# EAGLE design Rib (EAGLE 8.6.3)
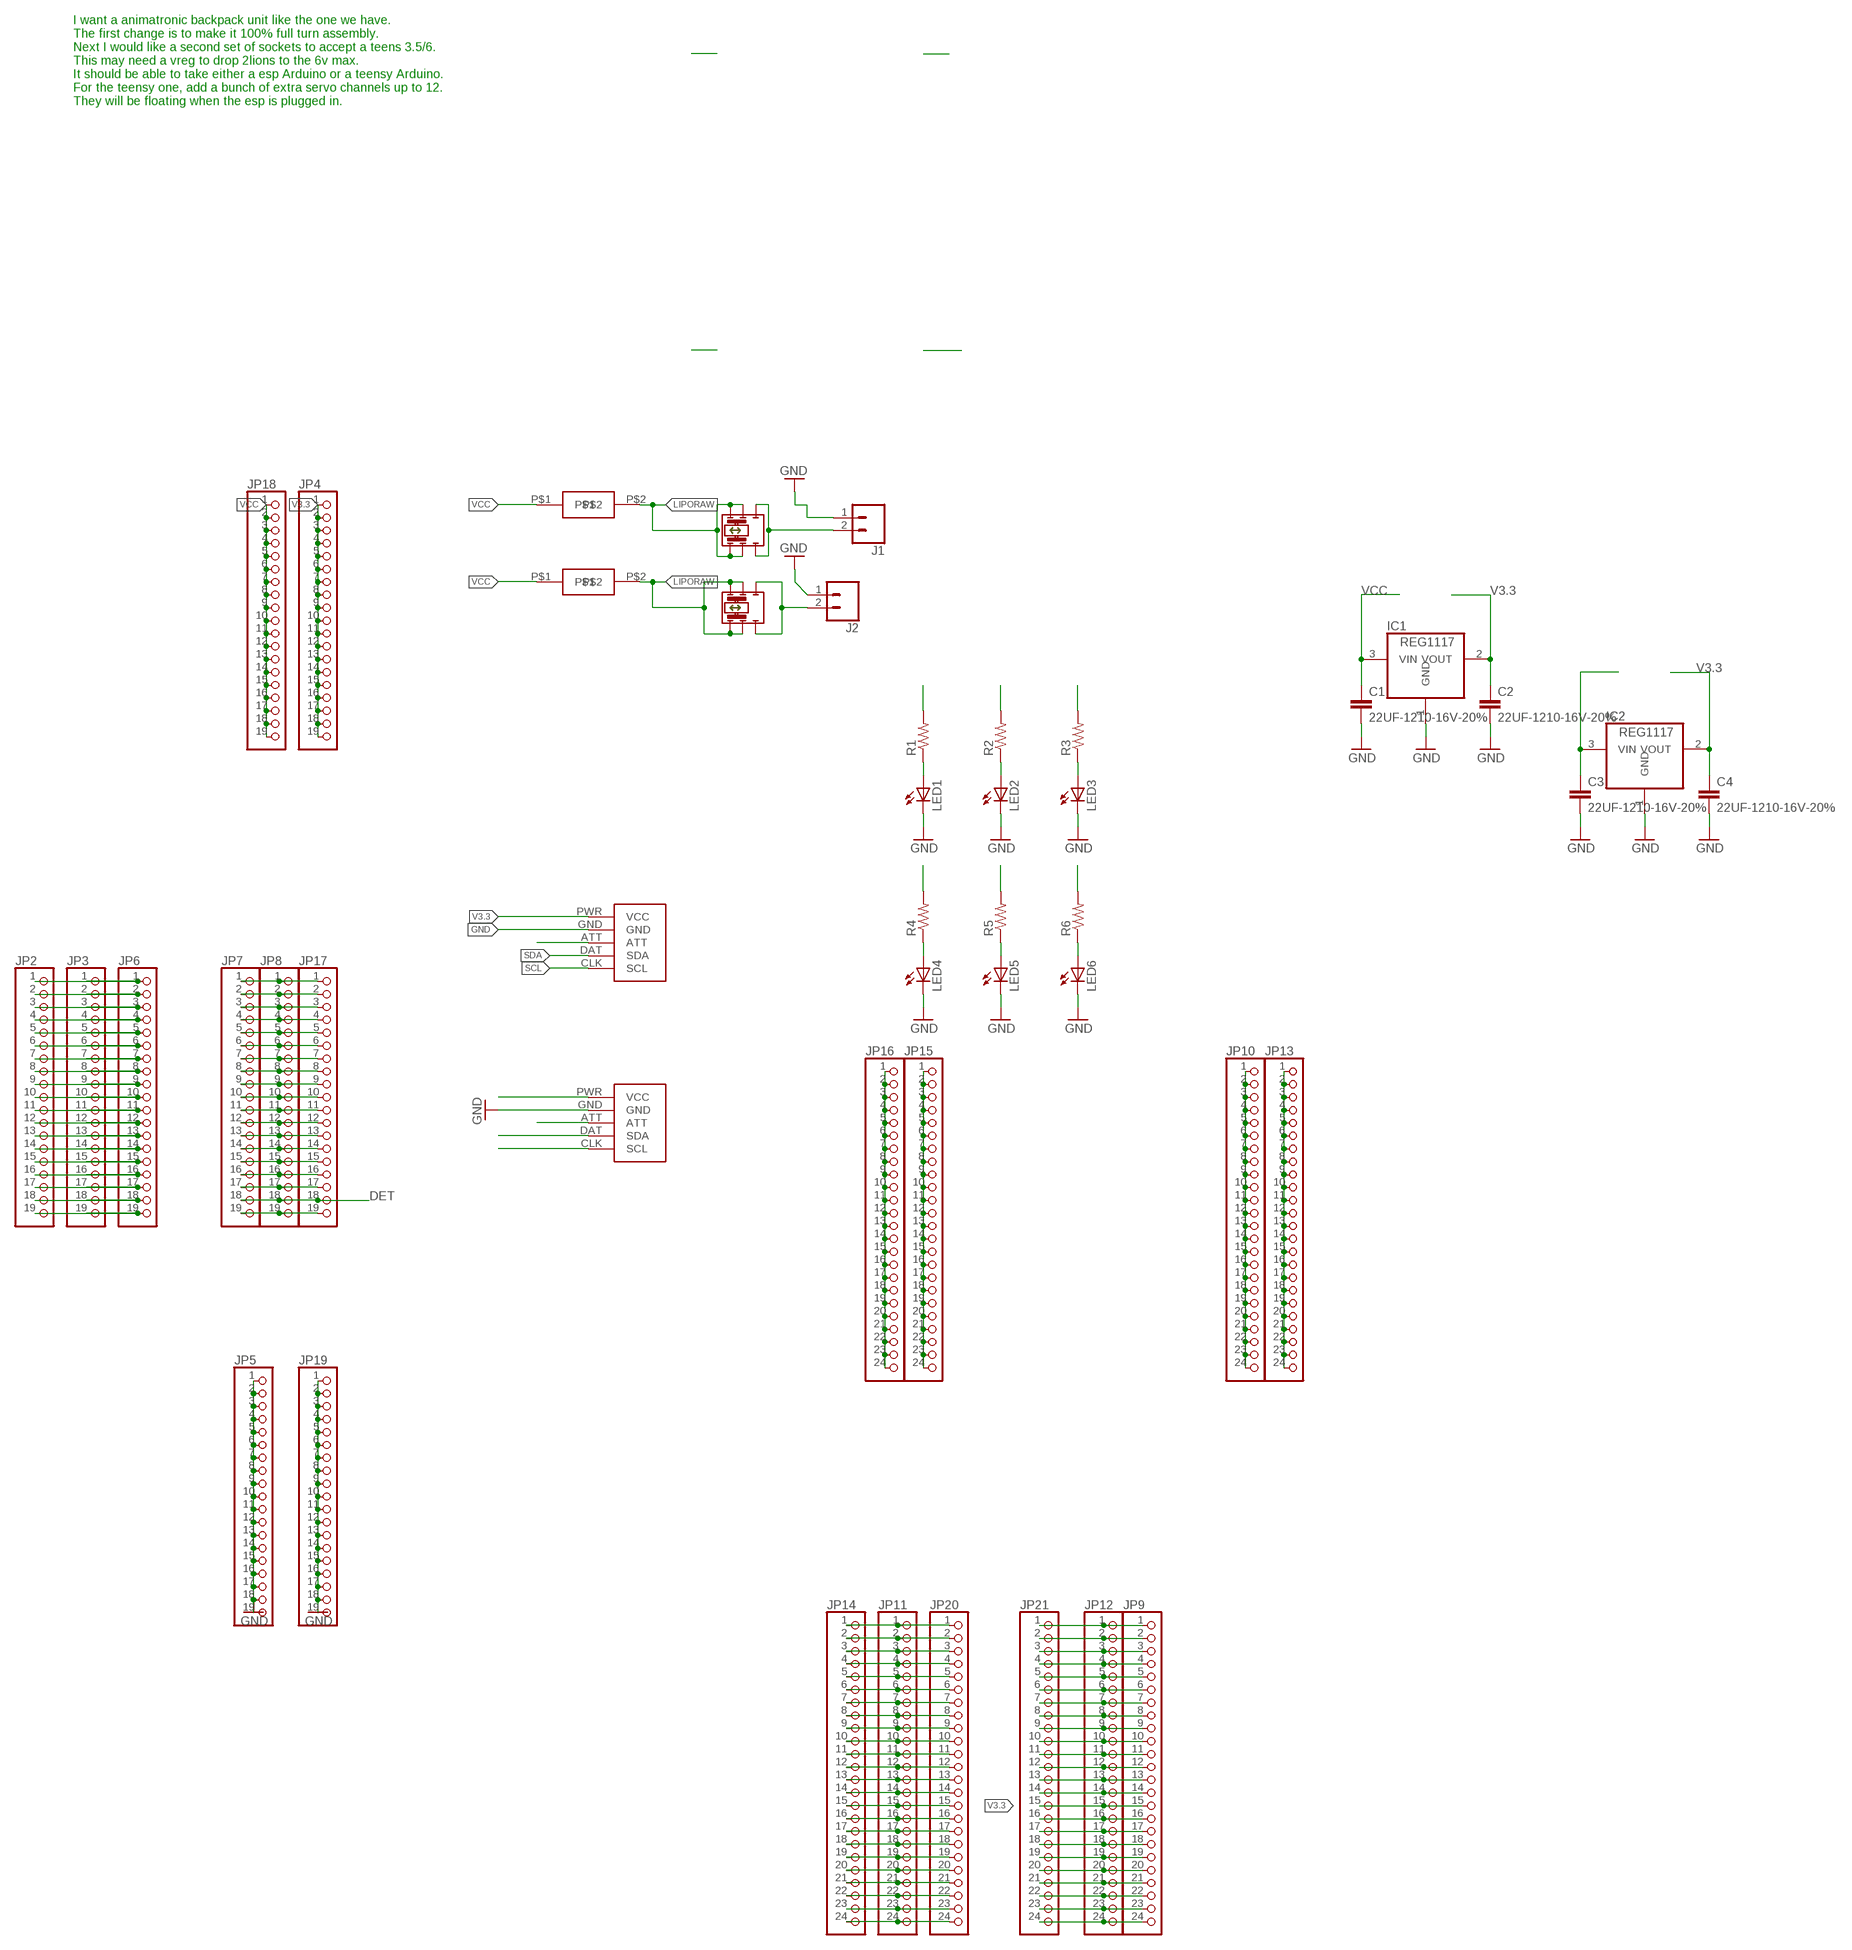
[diagram p0: schematic, sheet 1]

## Parts
C1  22UF-1210-16V-20%  [1210]
C2  22UF-1210-16V-20%  [1210]
C3  22UF-1210-16V-20%  [1210]
C4  22UF-1210-16V-20%  [1210]
F3  3557-2  [3557-2]
F4  3557-2  [3557-2]
IC1  REG1117  [SOT223]
IC2  REG1117  [SOT223]
J1  CONN_023.5MM_LOCK  [SCREWTERMINAL-3.5MM-2_LOCK]
J2  CONN_023.5MM_LOCK  [SCREWTERMINAL-3.5MM-2_LOCK]
JP2  PINHD-1X19  [1X19]
JP3  PINHD-1X19  [1X19]
JP4  PINHD-1X19  [1X19]
JP5  PINHD-1X19  [1X19]
JP6  PINHD-1X19  [1X19]
JP7  PINHD-1X19  [1X19]
JP8  PINHD-1X19  [1X19]
JP9  PINHD-1X24  [1X24]
JP10  PINHD-1X24  [1X24]
JP11  PINHD-1X24  [1X24]
JP12  PINHD-1X24  [1X24]
JP13  PINHD-1X24  [1X24]
JP14  PINHD-1X24  [1X24]
JP15  PINHD-1X24  [1X24]
JP16  PINHD-1X24  [1X24]
JP17  PINHD-1X19  [1X19]
JP18  PINHD-1X19  [1X19]
JP19  PINHD-1X19  [1X19]
JP20  PINHD-1X24  [1X24]
JP21  PINHD-1X24  [1X24]
LED1  LED_ESML0603  [LED_SML0603]
LED2  LED_ESML0603  [LED_SML0603]
LED3  LED_ESML0603  [LED_SML0603]
LED4  LED_ESML0603  [LED_SML0603]
LED5  LED_ESML0603  [LED_SML0603]
LED6  LED_ESML0603  [LED_SML0603]
R1  R-US_R0603  [R0603]
R2  R-US_R0603  [R0603]
R3  R-US_R0603  [R0603]
R4  R-US_R0603  [R0603]
R5  R-US_R0603  [R0603]
R6  R-US_R0603  [R0603]
SW1  DPDT  [GF-126-0327]
SW2  DPDT  [GF-126-0327]
U$3  WIICHUCK  [CHUCK]
U$5  WIICHUCK  [CHUCK]

## Nets
5V: JP2.1 JP3.1 JP6.1 JP11.1 JP14.1 JP20.1
DET: JP7.18 JP8.18 JP9.24 JP12.24 JP17.18 JP21.24 U$3.ATT U$5.ATT
GND: C1.2 C2.2 C3.2 C4.2 IC1.1(GND) IC2.1(GND) J1.1 J2.1 JP2.6 JP3.6 JP5.1 JP5.2 JP5.3 JP5.4 JP5.5 JP5.6 JP5.7 JP5.8 JP5.9 JP5.10 JP5.11 JP5.12 JP5.13 JP5.14 JP5.15 JP5.16 JP5.17 JP5.18 JP5.19 JP6.6 JP7.13 JP7.19 JP8.13 JP8.19 JP9.1 JP11.2 JP11.15 JP12.1 JP13.1 JP13.2 JP13.3 JP13.4 JP13.5 JP13.6 JP13.7 JP13.8 JP13.9 JP13.10 JP13.11 JP13.12 JP13.13 JP13.14 JP13.15 JP13.16 JP13.17 JP13.18 JP13.19 JP13.20 JP13.21 JP13.22 JP13.23 JP13.24 JP14.2 JP14.15 JP16.1 JP16.2 JP16.3 JP16.4 JP16.5 JP16.6 JP16.7 JP16.8 JP16.9 JP16.10 JP16.11 JP16.12 JP16.13 JP16.14 JP16.15 JP16.16 JP16.17 JP16.18 JP16.19 JP16.20 JP16.21 JP16.22 JP16.23 JP16.24 JP17.13 JP17.19 JP19.1 JP19.2 JP19.3 JP19.4 JP19.5 JP19.6 JP19.7 JP19.8 JP19.9 JP19.10 JP19.11 JP19.12 JP19.13 JP19.14 JP19.15 JP19.16 JP19.17 JP19.18 JP19.19 JP20.2 JP20.15 JP21.1 LED1.C LED2.C LED3.C LED4.C LED5.C LED6.C U$3.GND U$5.GND
LIPORAW: F3.P$2 F4.P$2 R2.2 R5.2 SW1.A1 SW1.A2 SW1.B1 SW1.B2 SW2.A1 SW2.A2 SW2.B1 SW2.B2
N$1: JP11.23 JP14.23 JP20.23
N$6: JP11.24 JP14.24 JP20.24
N$7: JP2.2 JP3.2 JP6.2
N$8: JP2.3 JP3.3 JP6.3
N$9: JP2.4 JP3.4 JP6.4
N$10: JP2.5 JP3.5 JP6.5
N$11: J1.2 SW1.C1 SW1.C2
N$12: JP2.7 JP3.7 JP6.7
N$13: JP2.8 JP3.8 JP6.8
N$14: JP2.9 JP3.9 JP6.9
N$15: JP2.10 JP3.10 JP6.10
N$16: JP2.11 JP3.11 JP6.11
N$17: JP2.12 JP3.12 JP6.12
N$18: JP2.13 JP3.13 JP6.13
N$19: JP2.14 JP3.14 JP6.14
N$20: JP2.15 JP3.15 JP6.15
N$21: JP2.16 JP3.16 JP6.16
N$22: JP2.17 JP3.17 JP6.17
N$23: JP2.18 JP3.18 JP6.18
N$24: LED1.A R1.1
N$25: JP7.1 JP8.1 JP17.1
N$26: JP7.2 JP8.2 JP17.2
N$27: JP7.3 JP8.3 JP17.3
N$28: JP7.4 JP8.4 JP17.4
N$29: JP7.5 JP8.5 JP17.5
N$30: JP7.6 JP8.6 JP17.6
N$31: JP7.7 JP8.7 JP17.7
N$32: JP7.8 JP8.8 JP17.8
N$33: JP7.9 JP8.9 JP17.9
N$34: JP7.10 JP8.10 JP17.10
N$35: JP7.11 JP8.11 JP17.11
N$36: JP7.12 JP8.12 JP17.12
N$37: LED2.A R2.1
N$38: LED3.A R3.1
N$39: J2.2 SW2.C1 SW2.C2
N$40: LED4.A R4.1
N$41: LED5.A R5.1
N$42: LED6.A R6.1
N$62: JP11.3 JP14.3 JP20.3
N$63: JP11.4 JP14.4 JP20.4
N$64: JP11.5 JP14.5 JP20.5
N$65: JP11.6 JP14.6 JP20.6
N$66: JP11.7 JP14.7 JP20.7
N$69: JP11.10 JP14.10 JP20.10
N$70: JP11.11 JP14.11 JP20.11
N$71: JP11.12 JP14.12 JP20.12
N$72: JP11.13 JP14.13 JP20.13
N$73: JP11.14 JP14.14 JP20.14
N$75: JP11.16 JP14.16 JP20.16
N$76: JP11.17 JP14.17 JP20.17
N$77: JP11.18 JP14.18 JP20.18
N$78: JP11.19 JP14.19 JP20.19
N$79: JP11.20 JP14.20 JP20.20
N$80: JP11.21 JP14.21 JP20.21
N$81: JP11.22 JP14.22 JP20.22
N$85: JP9.2 JP12.2 JP21.2
N$86: JP9.3 JP12.3 JP21.3
N$87: JP9.4 JP12.4 JP21.4
N$88: JP9.5 JP12.5 JP21.5
N$89: JP9.6 JP12.6 JP21.6
N$90: JP9.7 JP12.7 JP21.7
N$91: JP9.8 JP12.8 JP21.8
N$92: JP9.9 JP12.9 JP21.9
N$93: JP9.10 JP12.10 JP21.10
N$96: JP9.13 JP12.13 JP21.13
N$97: JP9.14 JP12.14 JP21.14
N$99: JP9.16 JP12.16 JP21.16
N$100: JP9.17 JP12.17 JP21.17
N$101: JP9.18 JP12.18 JP21.18
N$102: JP9.19 JP12.19 JP21.19
N$103: JP9.20 JP12.20 JP21.20
N$104: JP9.21 JP12.21 JP21.21
N$105: JP9.22 JP12.22 JP21.22
N$106: JP9.23 JP12.23 JP21.23
RX0: JP7.15 JP8.15 JP9.12 JP12.12 JP17.15 JP21.12
SCL: JP7.17 JP8.17 JP11.8 JP14.8 JP17.17 JP20.8 U$3.CLK(SCL) U$5.CLK(SCL)
SDA: JP7.14 JP8.14 JP11.9 JP14.9 JP17.14 JP20.9 U$3.DAT(SDA) U$5.DAT(SDA)
TX0: JP7.16 JP8.16 JP9.11 JP12.11 JP17.16 JP21.11
V3.3: C2.1 C4.1 IC1.2(VOUT) IC2.2(VOUT) JP2.19 JP3.19 JP4.1 JP4.2 JP4.3 JP4.4 JP4.5 JP4.6 JP4.7 JP4.8 JP4.9 JP4.10 JP4.11 JP4.12 JP4.13 JP4.14 JP4.15 JP4.16 JP4.17 JP4.18 JP4.19 JP6.19 JP9.15 JP10.1 JP10.2 JP10.3 JP10.4 JP10.5 JP10.6 JP10.7 JP10.8 JP10.9 JP10.10 JP10.11 JP10.12 JP10.13 JP10.14 JP10.15 JP10.16 JP10.17 JP10.18 JP10.19 JP10.20 JP10.21 JP10.22 JP10.23 JP10.24 JP12.15 JP21.15 R3.2 R6.2 U$3.PWR(VCC) U$5.PWR(VCC)
VCC: C1.1 C3.1 F3.P$1 F4.P$1 IC1.3(VIN) IC2.3(VIN) JP15.1 JP15.2 JP15.3 JP15.4 JP15.5 JP15.6 JP15.7 JP15.8 JP15.9 JP15.10 JP15.11 JP15.12 JP15.13 JP15.14 JP15.15 JP15.16 JP15.17 JP15.18 JP15.19 JP15.20 JP15.21 JP15.22 JP15.23 JP15.24 JP18.1 JP18.2 JP18.3 JP18.4 JP18.5 JP18.6 JP18.7 JP18.8 JP18.9 JP18.10 JP18.11 JP18.12 JP18.13 JP18.14 JP18.15 JP18.16 JP18.17 JP18.18 JP18.19 R1.2 R4.2

## Notes on the sheet
- I want a animatronic backpack unit like the one we have.
  The first change is to make it 100% full turn assembly.
  Next I would like a second set of sockets to accept a teens 3.5/6. 
  This may need a vreg to drop 2lions to the 6v max.
  It should be able to take either a esp Arduino or a teensy Arduino.
  For the teensy one, add a bunch of extra servo channels up to 12. 
  They will be floating when the esp is plugged in.

## Library data of the parts
C1-C4 = SparkFun-Capacitors:22UF: 22µF ceramic capacitors A capacitor is a passive two-terminal electrical component used to store electrical energy temporarily in an electric field.
F3 F4 = 3557-2:3557-2
IC1 IC2 = burr-brown:REG1117: 800mA and 1A Low Dropout (LDO) Positive Regulator 1.8V, 2.5V, 2.85V, 3.3V, 5V, and Adj; MPN: REG1117; OC_FARNELL: 1097566; OC_NEWARK: 14P6981
J1 J2 = SparkFun-Connectors:CONN_02: Multi connection point. Often used as Generic Header-pin footprint for 0.1 inch spaced/style header connections On any of the 0.1 inch spaced packages, you can populate with these: Break Away Headers - Straight <https://www.sparkfun.com/products/116> (PRT-00116) Break Away Male Headers - Right Angle <https://www.sparkfun.com/products/553> (PRT-00553) Female Headers <https://www.sparkfun.com/products/115> (PRT-00115) Break Away Headers - Machine Pin <https://www.sparkfun.com/products/117> (PRT-00117) Break Away Female Headers - Swiss Machine Pin <https://www.sparkfun.com/products/743> (PRT-00743) For SCREWTERMINALS and SPRING TERMINALS visit here: Screw Terimnals on SparkFun.com <https://www.sparkfun.com/search/results?term=Screw+Terminals> (5mm/3.5mm/2.54mm spacing) This device is also useful as a general connection point to wire up your design to another part of your project. Our various solder wires solder well into these plated through hole pads. Hook-Up Wire - Assortment (Stranded, 22 AWG) <https://www.sparkfun.com/products/11375> (PRT-11375) Hook-Up Wire - Assortment (Solid Core, 22 AWG) <https://www.sparkfun.com/products/11367> (PRT-11367) View the entire wire category on our website here <https://www.sparkfun.com/categories/141> Special notes: Molex polarized connector foot print use with: PRT-08233 with associated crimp pins and housings. 2.54_SCREWTERM for use with PRT-10571. 3.5mm Screw Terminal footprints for PRT-08084 5mm Screw Terminal footprints for use with PRT-08432; PROD_ID: CONN-08399
JP2-JP8 JP17-JP19 = headers:PINHD-1X19: PIN HEADER
JP9-JP16 JP20 JP21 = headers:PINHD-1X24: PIN HEADER
LED1-LED6 = eagle-ltspice:LED_E: LED Source: http://www.osram.convergy.de Source: www.luxeon.com Source: www.kingbright.com; SPICEMODEL: NONE; SPICEPREFIX: D; SPICETYPE: diode
R1-R6 = resistor:R-US_: RESISTOR, American symbol
SW1 SW2 = GF-126-0327:DPDT
U$3 U$5 = wiichuck:WIICHUCK

## Board
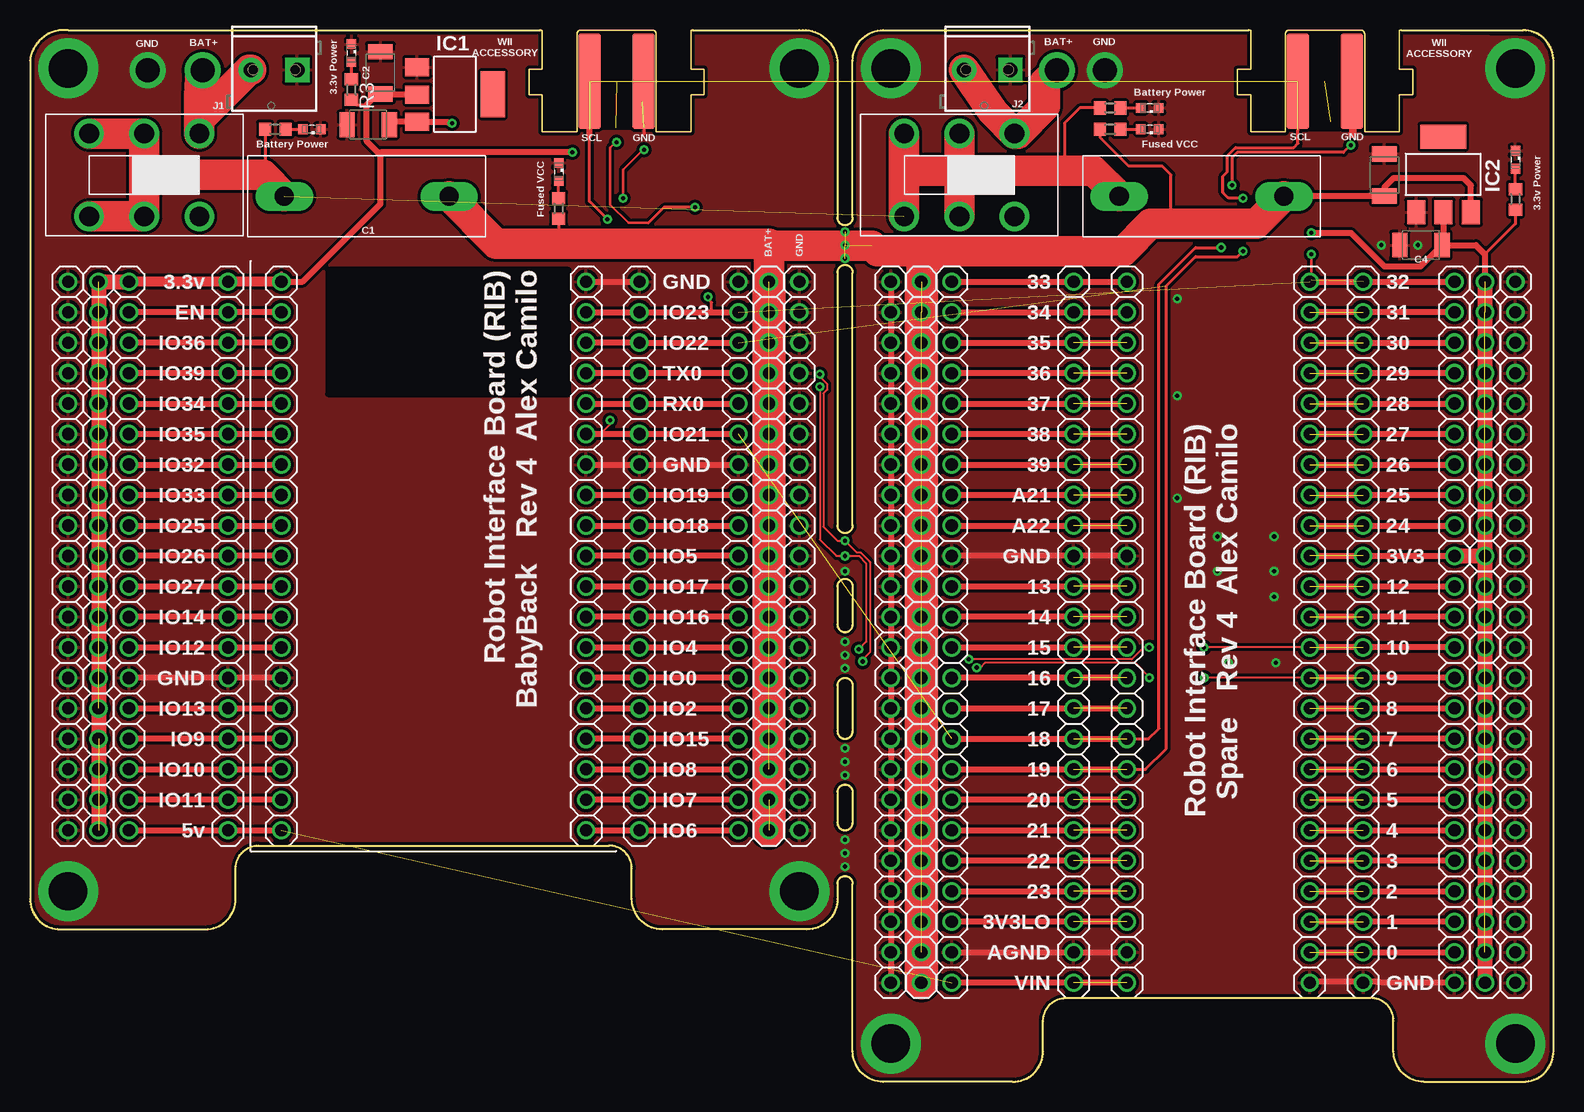
[diagram p1: board, top side]
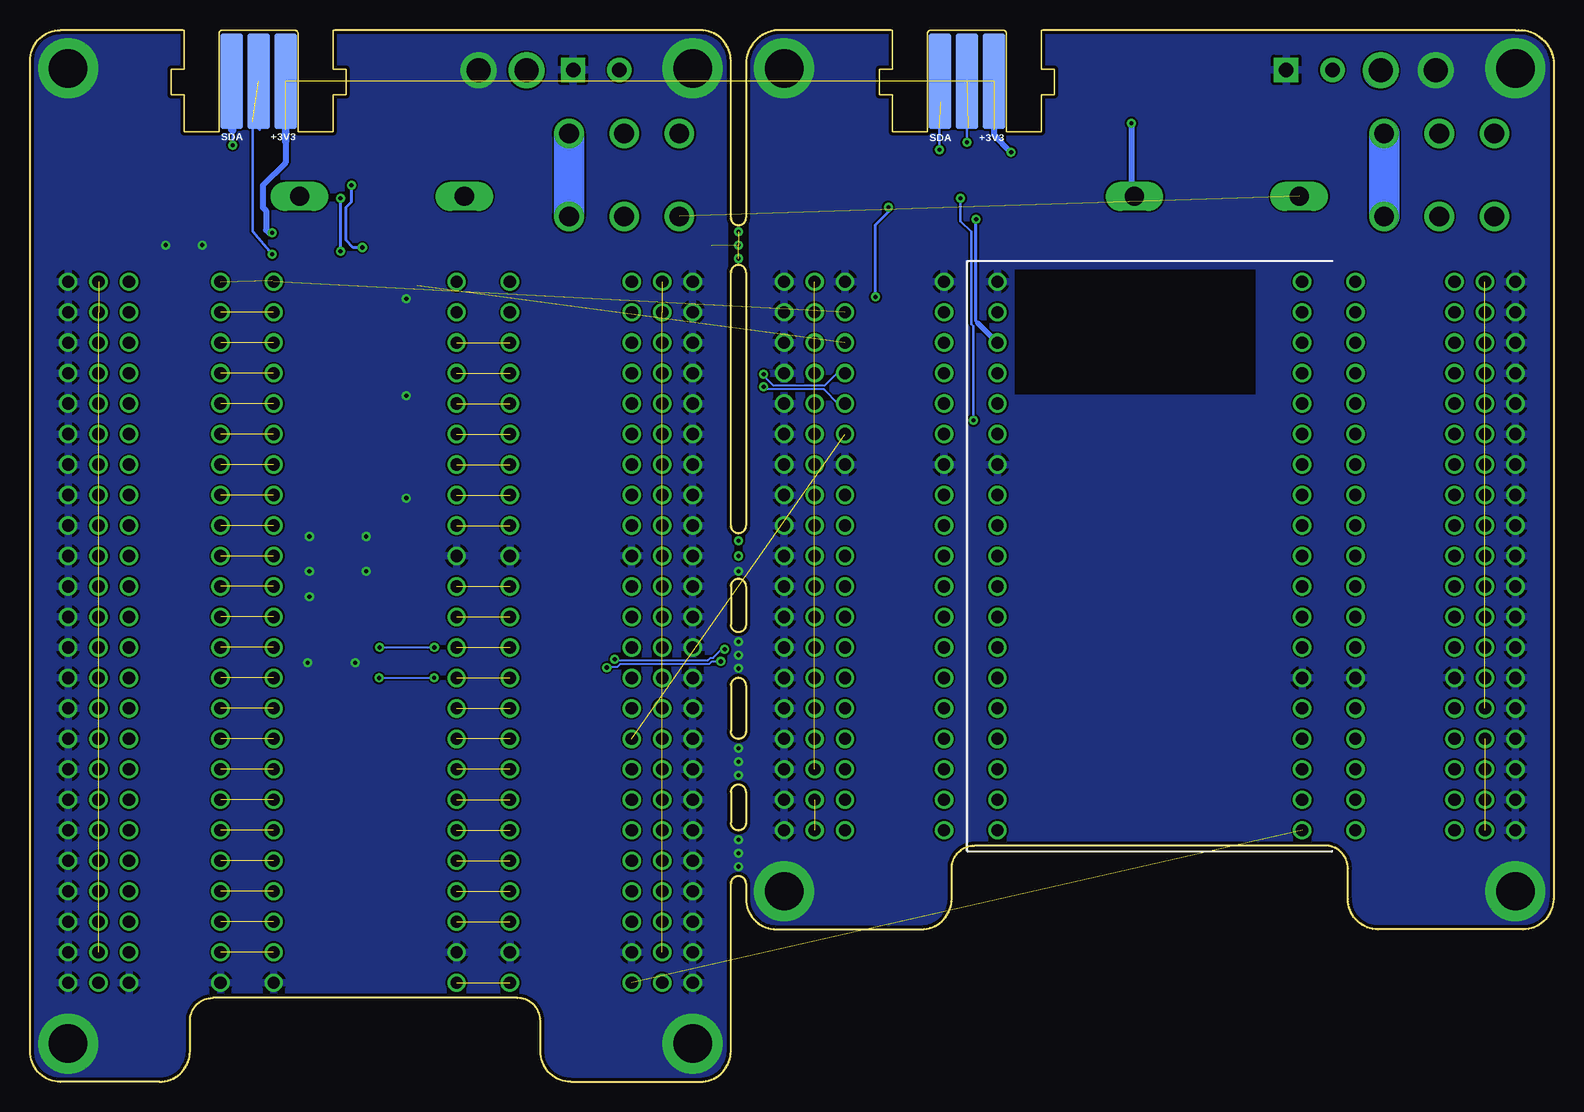
[diagram p2: board, bottom side, seen from below]

Size 127 x 87.65 mm. Coordinates in mm from the lower left corner, seen from the top.
Outline: 42.55,87.63 3.17,87.63 arc90 0,85.09 0,15.24 arc90 2.54,12.7 14.6,12.7 arc90 17.14,15.24 17.14,17.78 arc-90 19.05,19.68 48.26,19.68 arc-90 50.16,17.78 50.16,15.24 arc90 52.7,12.7 64.77,12.7 arc90 67.31,15.24 67.31,16.51 arc-90 67.94,17.14 arc-90 68.58,16.51 68.58,2.54 arc90 71.12,0 81.91,0 arc90 84.46,2.54 84.46,5.08 arc-90 86.36,6.98 111.76,6.98 arc-90 113.66,5.08 113.66,2.54 arc90 116.21,0 124.46,0 arc90 127,2.54 127,85.09 arc90 124.46,87.63 114.3,87.63
Outline: 55.24,87.63 64.13,87.63 arc-90 67.31,85.09 67.31,72.01 arc90 67.94,71.37 arc90 68.58,72.01 68.58,85.09 arc-90 71.12,87.63 101.6,87.63
Outline: 67.31,67.44 arc-90 67.94,68.07 arc-90 68.58,67.44 68.58,46.36 arc-90 67.94,45.72 arc-90 67.31,46.36 67.31,67.44
Outline: 67.31,21.59 arc90 67.94,20.95 arc90 68.58,21.59 68.58,24.13 arc90 67.94,24.77 arc90 67.31,24.13 67.31,21.59
Outline: 67.31,41.27 arc-90 67.94,41.91 arc-90 68.58,41.27 68.58,38.1 arc-90 67.94,37.47 arc-90 67.31,38.1 67.31,41.27
Outline: 67.31,29.21 arc90 67.94,28.57 arc90 68.58,29.21 68.58,33.02 arc90 67.94,33.66 arc90 67.31,33.02 67.31,29.21
Copper layers (1*16): Top 0.035mm / dielectric 1.5mm / Bottom 0.035mm
Design rules "default *": minimum track width 6mil, minimum drill 0.35mm, track to track 6mil, track to pad 6mil, pad to pad 6mil, via to via 6mil, smd to smd 6mil, copper to edge 10mil, drill to drill 6mil, minimum pad ring 10mil, minimum via ring 8mil, stop-mask expansion 4mil, vias tented up to drill 30mil, thermal gap 10mil
tRestrict: area 45.2,79.6 to 52.7,88.3; area 104.1,79.5 to 111.6,88.1; area 24.8,57.3 to 44.9,67.7
bRestrict: area 104.2,79.4 to 111.6,88.1; area 45.2,79.6 to 52.7,88.3; area 24.8,57.3 to 44.9,67.7; area 67.1,67.8 to 68.8,71.7

### Footprints (pad centres in the part's own frame; a part is rotated, then mirrored left to right if it is on the bottom)
1210 = smd 1.27 x 2.06: 1 -1.755,0; 2 1.755,0
3557-2 = drill 1.6 long: P$1 6.87,0; P$2 -6.87,0
SOT223 = smd 1.499 x 2.007: 1 -2.261,-3.15; 2 0.025,-3.15; 3 2.311,-3.15 | smd 3.81 x 2.007: 4 0,3.15
SCREWTERMINAL-3.5MM-2_LOCK = drill 1.2 pad 2.032 square: 1 -0.178,0 | drill 1.2 pad 2.032: 2 3.678,0
1X19 = drill 1.016: 1 -22.86,0; 2 -20.32,0; 3 -17.78,0; 4 -15.24,0; 5 -12.7,0; 6 -10.16,0; 7 -7.62,0; 8 -5.08,0; 9 -2.54,0; 10 0,0; 11 2.54,0; 12 5.08,0; 13 7.62,0; 14 10.16,0; 15 12.7,0; 16 15.24,0; 17 17.78,0; 18 20.32,0; 19 22.86,0
1X24 = drill 1.016: 1 -29.21,0; 2 -26.67,0; 3 -24.13,0; 4 -21.59,0; 5 -19.05,0; 6 -16.51,0; 7 -13.97,0; 8 -11.43,0; 9 -8.89,0; 10 -6.35,0; 11 -3.81,0; 12 -1.27,0; 13 1.27,0; 14 3.81,0; 15 6.35,0; 16 8.89,0; 17 11.43,0; 18 13.97,0; 19 16.51,0; 20 19.05,0; 21 21.59,0; 22 24.13,0; 23 26.67,0; 24 29.21,0
LED_SML0603 = smd 0.8 x 0.8: A 0.75,0; C -0.75,0
R0603 = smd 1 x 1.1: 1 -0.85,0; 2 0.85,0
GF-126-0327 = drill 1.651: A1 -4.597,3.454; A2 -4.597,-3.454; B1 0,3.454; B2 0,-3.454; C1 4.597,3.454; C2 4.597,-3.454
CHUCK = smd 8 x 1.88 bottom: ATT -4.25,0; DAT -4.25,-2.255; PWR -4.25,2.255 | smd 8 x 1.88: CLK -4.25,2.255; GND -4.25,-2.255

### Placement (x,y rotation side)
C1  28.19,79.76 180 top
C2  29.21,84.07 90 top
C3  112.9,75.56 90 top
C4  115.95,69.72 180 top
F3  28.07,73.79 0 top
F4  97.66,73.79 0 top
IC1  35.43,82.3 270 top
IC2  117.81,75.62 0 top
J1  22.1,84.33 180 top
J2  81.55,84.33 180 top
JP2  16.51,43.81 90 top
JP3  8.25,43.81 90 top
JP4  5.71,43.81 90 top
JP5  3.17,43.81 90 top
JP6  20.95,43.81 90 top
JP7  46.36,43.81 90 top
JP8  50.8,43.81 90 top
JP9  118.75,37.47 90 top
JP10  121.28,37.47 90 top
JP11  87,37.47 90 top
JP12  111.12,37.47 90 top
JP13  123.82,37.47 90 top
JP14  76.84,37.47 90 top
JP15  74.3,37.47 90 top
JP16  71.75,37.47 90 top
JP17  59.05,43.81 90 top
JP18  61.59,43.81 90 top
JP19  64.13,43.81 90 top
JP20  91.44,37.47 90 top
JP21  106.68,37.47 90 top
LED1  44.07,75.82 270 top
LED2  23.49,79.38 180 top
LED3  26.8,85.72 270 top
LED4  93.34,79.38 180 top
LED5  93.34,81.15 180 top
LED6  123.82,76.84 270 top
R1  44.07,72.77 270 top
R2  20.45,79.38 180 top
R3  26.8,82.68 270 top
R4  90.04,79.38 180 top
R5  90.04,81.15 180 top
R6  123.82,73.53 270 top
SW1  9.52,75.56 0 top
SW2  77.47,75.56 0 top
U$3  107.95,87.63 90 top
U$5  48.89,87.63 90 top

### Tracks (layer width: path | path; a pad name or v marks a point on that pad's centre or on a via)
5V  (2 unrouted)
  Top 0.508: JP3.1 JP2.1 JP6.1 | JP20.1 JP14.1
DET  (via drill 0.35)  (4 unrouted)
  Top 0.203: 51.56,71.58 49.89,71.58 48.36,73.1 48.36,77.83 48.82,78.28 v48.89,78.28 | JP21.24 106.81,66.8 v106.81,68.96
  Top 0.254: 56.82,64.13 56.82,64.95 56.36,65.41 v56.52,65.41 | v55.45,72.87 52.86,72.87 51.56,71.58
  Top 0.508: JP7.18 JP8.18 56.82,64.13 JP17.18 | JP21.24 JP9.24
  Bottom 0.203: v48.89,78.28 48.89,79.43 48.82,79.5 | 107.87,79.32 108.46,80.01 108.46,70.87 v106.81,68.96
  Bottom 0.254: v56.52,65.41 56.52,71.42 55.37,72.57 55.45,72.64 v55.45,72.87
GND  (via drill 0.35, 2, 3.2 pad 5)
  Top 0.254: 110.21,78.97 110.21,78.87 110.26,78.82 | U$5.GND 51.18,83.35 51.18,78.99
  Top 0.508: JP16.24 JP16.1 | JP7.19 JP8.19 | JP7.13 JP8.13 JP17.13 | JP6.6 JP2.6 JP3.6 | JP20.15 JP14.15 | JP14.2 JP20.2 | 106.68,8.33 112.32,8.33 112.75,8.25 JP9.1
  Top 0.61: U$3.GND 110.21,80.55 110.26,80.49 110.26,79.03 110.21,78.97
  other vias: 3.17,15.88 123.82,3.18 64.13,15.88 71.75,3.18 67.94,42.55 67.94,20.17 67.94,19.05 67.94,17.93 67.94,36.68 67.94,35.56 67.94,34.44 67.94,27.79 67.94,26.67 67.94,25.55 3.17,84.45 123.82,84.45 64.13,84.45 71.75,84.45 103.71,40.41 103.71,45.44 98.98,45.44 95.63,65.25 95.63,48.64 95.63,57.18 95.63,57.18 98.98,42.55 103.71,42.55 103.86,34.92 99.9,34.92 9.81,84.28 89.62,84.28 112.65,69.72 115.7,69.72
  pour Bottom: -8.61,103.4 134.26,103.4 136.8,-20.9 -11.05,-20.9 -11.05,80.37
  pour Top (isolate 0.254): -11.25,89.41 136.12,86.87 136.12,-9.8 -6.58,-9.8 -6.58,25.17
LIPORAW  (1 unrouted)
  Top 0.254: R2.2 19.6,75.74 19.42,75.56 | R5.2 87.5,81.15 86.23,79.88 86.23,75.92
  Top 2.54: SW1.A1 SW1.B1 9.52,75.56 | SW1.A2 SW1.B2 9.52,75.56 | 72.87,75.92 SW2.A1 | 72.87,75.92 SW2.A2 | SW2.B1 77.47,75.92 | 77.47,75.92 SW2.B2 | 77.47,75.92 72.87,75.92 | F3.P$2 19.42,75.56 9.52,75.56 | F4.P$2 88.66,75.92 86.23,75.92 77.47,75.92
N$1
  Top 0.508: JP14.23 JP11.23 JP20.23
N$6
  Top 0.508: JP14.24 JP11.24 JP20.24
N$7
  Top 0.508: JP6.2 JP2.2 JP3.2
N$8
  Top 0.508: JP3.3 JP2.3 JP6.3
N$9
  Top 0.508: JP6.4 JP2.4 JP3.4
N$10
  Top 0.508: JP3.5 JP2.5 JP6.5
N$11  (via drill 2)
  Top 2.54: J1.2 18.29,84.33 14.12,80.16 SW1.C1 14.12,82.17 14.21,84.28 v14.41,84.28
  Bottom 2.54: SW1.C2 SW1.C1 | v14.41,84.28 14.61,84.08
N$12
  Top 0.508: JP3.7 JP2.7 JP6.7
N$13
  Top 0.508: JP6.8 JP2.8 JP3.8
N$14
  Top 0.508: JP3.9 JP2.9 JP6.9
N$15
  Top 0.508: JP6.10 JP2.10 JP3.10
N$16
  Top 0.508: JP3.11 JP2.11 JP6.11
N$17
  Top 0.508: JP6.12 JP2.12 JP3.12
N$18
  Top 0.508: JP3.13 JP2.13 JP6.13
N$19
  Top 0.508: JP6.14 JP2.14 JP3.14
N$20
  Top 0.508: JP3.15 JP2.15 JP6.15
N$21
  Top 0.508: JP6.16 JP2.16 JP3.16
N$22
  Top 0.508: JP3.17 JP2.17 JP6.17
N$23
  Top 0.508: JP6.18 JP2.18 JP3.18
N$24
  Top 0.254: R1.1 LED1.A
N$25
  Top 0.508: JP7.1 JP8.1 JP17.1
N$26
  Top 0.508: JP17.2 JP8.2 JP7.2
N$27
  Top 0.508: JP7.3 JP8.3 JP17.3
N$28
  Top 0.508: JP17.4 JP8.4 JP7.4
N$29
  Top 0.508: JP7.5 JP8.5 JP17.5
N$30
  Top 0.508: JP17.6 JP8.6 JP7.6
N$31
  Top 0.508: JP7.7 JP8.7 JP17.7
N$32
  Top 0.508: JP17.8 JP8.8 JP7.8
N$33
  Top 0.508: JP7.9 JP8.9 JP17.9
N$34
  Top 0.508: JP17.10 JP8.10 JP7.10
N$35
  Top 0.508: JP7.11 JP8.11 JP17.11
N$36
  Top 0.508: JP17.12 JP8.12 JP7.12
N$37
  Top 0.254: R2.1 LED2.A
N$38
  Top 0.254: R3.1 LED3.A
N$39  (via drill 2)
  Top 2.54: J2.2 80.27,80.82 SW2.C1 82.36,79.02 84.62,81.28 84.62,83.28 v85.62,84.28
  Bottom 2.54: SW2.C1 SW2.C2
N$40
  Top 0.254: R4.1 LED4.A
N$41
  Top 0.254: R5.1 LED5.A
N$42
  Top 0.254: R6.1 LED6.A
N$62  (1 unrouted)
  Top 0.508: JP20.3 JP14.3
N$63  (1 unrouted)
  Top 0.508: JP14.4 JP20.4
N$64  (1 unrouted)
  Top 0.508: JP20.5 JP14.5
N$65  (1 unrouted)
  Top 0.508: JP14.6 JP20.6
N$66  (1 unrouted)
  Top 0.508: JP20.7 JP14.7
N$69  (1 unrouted)
  Top 0.508: JP14.10 JP20.10
N$70  (1 unrouted)
  Top 0.508: JP20.11 JP14.11
N$71  (1 unrouted)
  Top 0.508: JP14.12 JP20.12
N$72  (1 unrouted)
  Top 0.508: JP20.13 JP14.13
N$73  (1 unrouted)
  Top 0.508: JP14.14 JP20.14
N$75  (1 unrouted)
  Top 0.508: JP14.16 JP20.16
N$76  (1 unrouted)
  Top 0.508: JP20.17 JP14.17
N$77  (1 unrouted)
  Top 0.508: JP14.18 JP20.18
N$78  (1 unrouted)
  Top 0.508: JP20.19 JP14.19
N$79  (1 unrouted)
  Top 0.508: JP14.20 JP20.20
N$80  (1 unrouted)
  Top 0.508: JP20.21 JP14.21
N$81  (1 unrouted)
  Top 0.508: JP14.22 JP20.22
N$85  (1 unrouted)
  Top 0.508: JP21.2 JP9.2
N$86  (1 unrouted)
  Top 0.508: JP9.3 JP21.3
N$87  (1 unrouted)
  Top 0.508: JP21.4 JP9.4
N$88  (1 unrouted)
  Top 0.508: JP9.5 JP21.5
N$89  (1 unrouted)
  Top 0.508: JP21.6 JP9.6
N$90  (1 unrouted)
  Top 0.508: JP9.7 JP21.7
N$91  (1 unrouted)
  Top 0.508: JP21.8 JP9.8
N$92  (1 unrouted)
  Top 0.508: JP9.9 JP21.9
N$93  (1 unrouted)
  Top 0.508: JP21.10 JP9.10
N$96  (1 unrouted)
  Top 0.508: JP9.13 JP21.13
N$97  (1 unrouted)
  Top 0.508: JP21.14 JP9.14
N$99  (1 unrouted)
  Top 0.508: JP21.16 JP9.16
N$100  (1 unrouted)
  Top 0.508: JP9.17 JP21.17
N$101  (1 unrouted)
  Top 0.508: JP21.18 JP9.18
N$102  (1 unrouted)
  Top 0.508: JP9.19 JP21.19
N$103  (1 unrouted)
  Top 0.508: JP21.20 JP9.20
N$104  (1 unrouted)
  Top 0.508: JP9.21 JP21.21
N$105  (1 unrouted)
  Top 0.508: JP21.22 JP9.22
N$106  (1 unrouted)
  Top 0.508: JP9.23 JP21.23
RX0  (via drill 0.35)  (1 unrouted)
  Top 0.152: v65.84,57.91 65.84,45.19 67.21,43.81 v67.94,43.81 69.09,43.81 69.7,43.2 69.7,36.65 v69.09,36.04 | JP21.12 v97.87,36.2 | v93.29,36.2 92.84,36.2 91.85,35.2 v78.26,35.2
  Top 0.508: JP7.15 JP8.15 JP17.15 | JP9.12 JP21.12
  Bottom 0.152: JP17.15 59.64,56.52 60.83,57.71 65.61,57.71 65.81,57.91 v65.84,57.91 | v97.87,36.2 v93.29,36.2 93.27,36.2 | v78.26,35.2 78.18,35.13 70.48,35.13 70.28,35.33 70.05,35.33 69.34,36.04 v69.09,36.04
SCL  (via drill 0.35)  (4 unrouted)
  Top 0.254: JP20.8 92.99,26.04 94.72,27.76 94.72,66.32 97.16,68.76 100.66,68.76 v101.12,69.22 | v101.12,73.63 99.9,73.63 99.44,74.09 99.44,75.46 99.8,75.82 99.8,77.16 100.49,77.85 105.33,77.85 105.69,78.21 105.69,79.32 | v48.13,71.88 46.64,73.38 46.64,78.87
  Top 0.508: JP7.17 JP8.17 JP17.17 | JP14.8 JP20.8 | 46.64,78.87 46.64,79.35
  Bottom 0.254: v101.12,69.22 v101.12,73.63 | 47.98,63.22 48.13,63.37 v48.13,71.88
  Bottom 0.406: JP7.17 47.98,63.22
SDA  (via drill 0.35)  (3 unrouted)
  Top 0.152: JP7.14 47.52,53.98
  Top 0.203: 47.52,53.98 48.36,54.81 v48.36,55.12 | v49.43,73.63 49.43,76 51.03,77.6 v51.18,77.67
  Top 0.254: JP20.9 93.24,28.57 94.11,29.44 94.11,66.47 97.16,69.52 v99.29,69.52 | v110.11,78.05 109.5,77.44 100.66,77.44 100.2,76.99 v100.2,74.7
  Top 0.508: JP14.9 JP20.9 | JP17.14 JP8.14 47.52,53.98 JP7.14
  Bottom 0.203: v48.36,55.12 48.36,62.95 48.51,63.11 48.51,70.81 49.43,71.73 v49.43,73.63 | v51.18,77.67 51.18,79.5
  Bottom 0.254: v99.29,69.52 100.05,69.52 100.66,70.13 100.66,72.87 100.2,73.33 v100.2,74.7 | 110.11,79.3 v110.11,78.05 | U$5.DAT 51.18,83.35 51.18,82.8 51.05,82.68 51.05,81.66
  Bottom 0.61: U$3.DAT 110.21,79.4 110.11,79.3
TX0  (via drill 0.35)  (1 unrouted)
  Top 0.152: v65.84,58.95 65.84,58.77 66.44,58.16 66.44,57.66 66.14,57.36 66.14,46.25 67.34,45.06 67.92,45.06 v67.94,45.09 68.91,44.12 69.21,44.12 70,43.33 70,35.79 69.42,35.2 v69.42,35.03 | JP21.11 v97.89,33.66 | v93.32,33.68 93.32,33.71 92.13,34.9 79.6,34.9 79.22,34.52 v78.92,34.52
  Top 0.508: JP17.16 JP8.16 JP7.16 | JP9.11 JP21.11
  Bottom 0.152: JP17.16 59.74,59.05 60.78,58.01 65.02,58.01 65.81,58.8 v65.84,58.95 | v97.89,33.66 93.34,33.66 v93.32,33.68 | v78.92,34.52 78.84,34.6 78.01,34.6 77.78,34.82 70.36,34.82 70.16,35.03 v69.42,35.03
V3.3  (via drill 0.35)  (41 unrouted)
  Top 0.254: R3.2 27.22,81.41 28.07,81.41 | R6.2 123.82,71.5 121.28,68.96
  Top 0.406: 20.95,67.31 JP6.19
  Top 0.508: JP21.15 JP9.15 | 29.23,82.3 C2.1 | JP6.19 22.73,66.67 29.21,73.15 29.21,77.34 29.27,77.41 | IC1.2 29.26,82.27 C2.1 | 29.27,77.41 29.34,77.47 v45.21,77.47 | 29.27,77.41 29.02,77.41 28.07,78.36 28.07,81.41 28.98,82.32 C2.1 | IC2.2 117.83,69.85 C4.1 | C4.1 120.52,69.72 121.28,68.96 JP10.24 | v106.81,70.74 110.11,70.74 112.9,67.94 115.93,67.94 C4.1
  Top 0.61: 106.58,43.92 JP21.15
  Top 0.813: JP3.19 JP2.19 JP6.19
  Top 1.27: JP3.19 JP4.19 JP4.1 | JP9.15 JP10.15 | JP10.24 JP10.1
  Bottom 0.508: U$5.PWR 46.64,78.9 v45.21,77.47 | 105.69,78.37 105.69,76.6 107.59,74.71 107.59,72.87 107.31,72.59 107.31,70.99 107.06,70.74 v106.81,70.74
  Bottom 0.61: U$3.PWR 105.69,78.37
VCC  (via drill 0.35)  (42 unrouted)
  Top 0.254: R1.2 44.07,69.85 | 108.5,73.72 108.59,73.81 | R4.2 89.19,78.7 91.57,76.33 94.36,76.33 95.12,75.56 95.12,72.01 94.62,71.5 93.42,71.5
  Top 0.508: v35.18,79.88 34.92,79.88 34.82,79.98 IC1.3 30.18,79.98 C1.1 | IC2.3 120.12,74.7 119.51,75.31 113.66,75.31 112.9,74.55 C3.1 108.59,73.81 104.56,73.81 F4.P$1
  Top 1.016: JP18.19 61.59,20.65
  Top 2.54: 74.3,68.05 JP15.24 74.3,67.94 75.56,69.22 | 61.59,69.85 JP18.19 | 75.56,69.22 70.64,69.22 70.18,69.67 61.77,69.67 61.59,69.85 | 61.59,69.85 44.07,69.85 38.87,69.85 F3.P$1 | F4.P$1 102.25,71.5 93.42,71.5 91.13,69.22 75.56,69.22
  Top 2.794: JP18.1 JP18.19 | JP15.24 JP15.1
  Bottom 0.508: v35.18,79.88 35.18,74.03 F3.P$1
  other vias: 67.94,70.84 67.94,69.72 67.94,68.61

### Text on the board
tPlace: GND | BAT+ | BAT+ | GND | WII / ACCESSORY | WII / ACCESSORY | 3.3v Power | Battery Power | SCL | GND | SCL | GND | Battery Power | Fused VCC | Fused VCC | 3.3v Power | BAT+ | GND | Robot Interface Board (RIB) / BabyBack Rev 4 Alex Camilo | 3.3v | GND | 33 | 32 | EN | IO23 | 34 | 31 | IO36 | IO22 | 35 | 30 | IO39 | TX0 | 36 | 29 | IO34 | RX0 | 37 | 28 | Robot Interface Board (RIB) / Spare Rev 4 Alex Camilo | IO35 | IO21 | 38 | 27 | IO32 | GND | 39 | 26 | IO33 | IO19 | A21 | 25 | IO25 | IO18 | A22 | 24 | IO26 | IO5 | GND | 3V3 | IO27 | IO17 | 13 | 12 | IO14 | IO16 | 14 | 11 | IO12 | IO4 | 15 | 10 | GND | IO0 | 16 | 9 | IO13 | IO2 | 17 | 8 | IO9 | IO15 | 18 | 7 | IO10 | IO8 | 19 | 6 | IO11 | IO7 | 20 | 5 | 5v | IO6 | 21 | 4 | 22 | 3 | 23 | 2 | 3V3LO | 1 | AGND | 0 | VIN | GND
bPlace: +3V3 | SDA | +3V3 | SDA